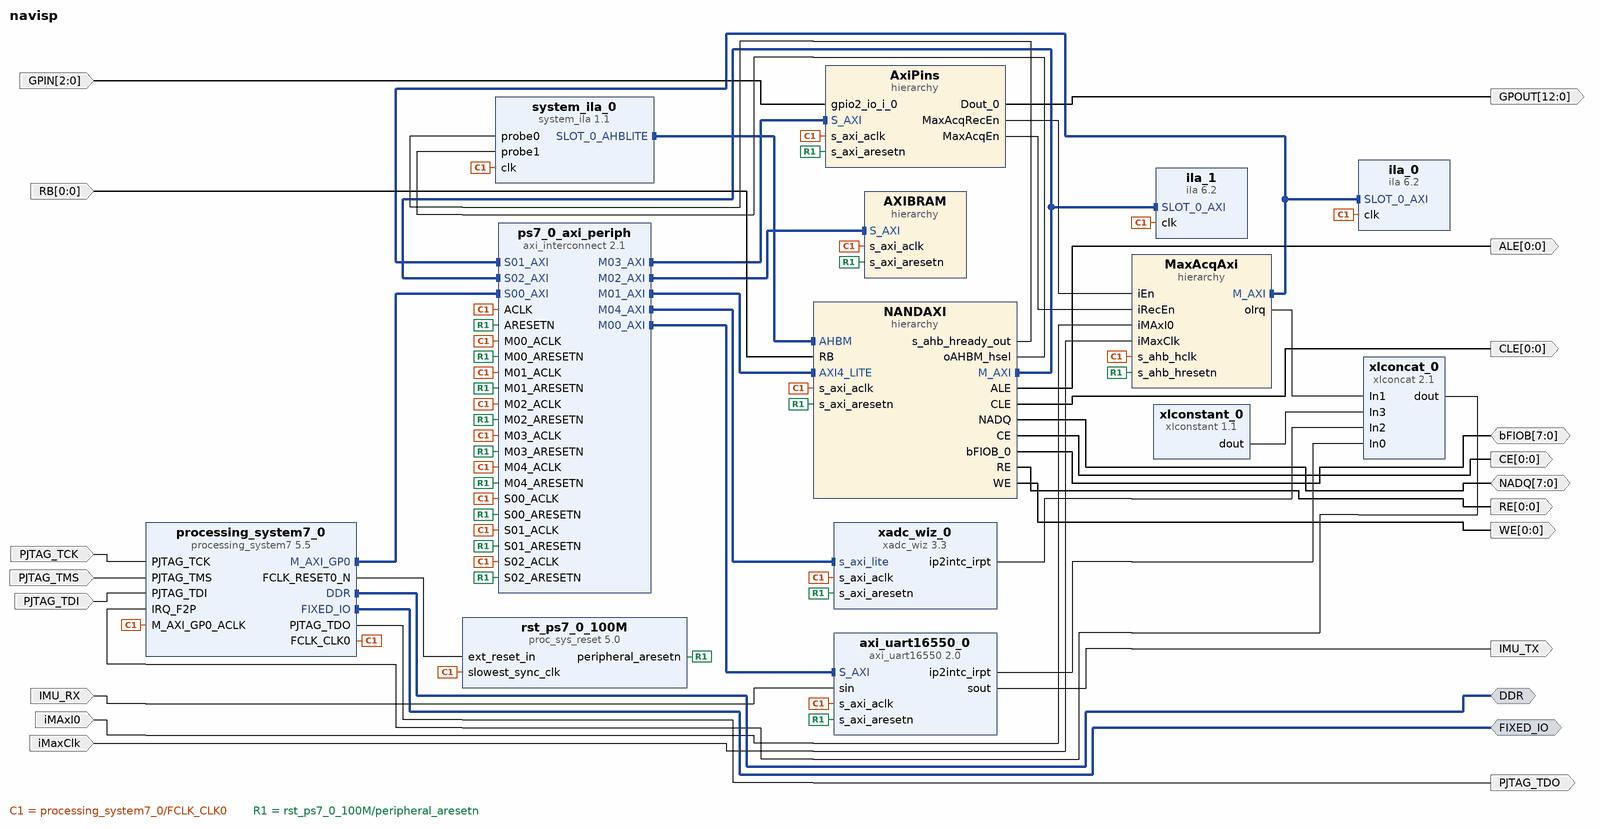
[diagram p0: block diagram of the top level]
# Vivado block design navisp, xc7z030sbg485-1, Vivado 2019.1.1
create_bd_design navisp

create_bd_intf_port -mode Master -vlnv xilinx.com:interface:ddrx_rtl:1.0 DDR
create_bd_intf_port -mode Master -vlnv xilinx.com:display_processing_system7:fixedio_rtl:1.0 FIXED_IO
create_bd_port -dir I -type clk PJTAG_TCK
create_bd_port -dir I PJTAG_TMS
create_bd_port -dir I PJTAG_TDI
create_bd_port -dir O PJTAG_TDO
create_bd_port -dir I iMAxI0
create_bd_port -dir I iMaxClk
create_bd_port -dir IO -from 7 -to 0 NADQ
create_bd_port -dir O -from 0 -to 0 CLE
create_bd_port -dir O -from 0 -to 0 ALE
create_bd_port -dir O -from 0 -to 0 RE
create_bd_port -dir O -from 0 -to 0 CE
create_bd_port -dir O -from 0 -to 0 WE
create_bd_port -dir I -from 0 -to 0 RB
create_bd_port -dir I -from 2 -to 0 GPIN
create_bd_port -dir I IMU_RX
create_bd_port -dir O IMU_TX
create_bd_port -dir IO -from 7 -to 0 bFIOB
create_bd_port -dir O -from 12 -to 0 GPOUT

create_bd_cell -type ip -vlnv xilinx.com:ip:axi_interconnect:2.1 ps7_0_axi_periph
set_property -dict {CONFIG.ENABLE_ADVANCED_OPTIONS 0 CONFIG.NUM_MI 5 CONFIG.NUM_SI 3} [get_bd_cells ps7_0_axi_periph]
create_bd_cell -type hier AXIBRAM
create_bd_cell -type hier NANDAXI
create_bd_cell -type hier AxiPins
create_bd_cell -type hier MaxAcqAxi
create_bd_cell -type ip -vlnv xilinx.com:ip:ila:6.2 ila_0
set_property -dict [list \
  CONFIG.ALL_PROBE_SAME_MU true \
  CONFIG.C_ADV_TRIGGER false \
  CONFIG.C_ENABLE_ILA_AXI_MON true \
  CONFIG.C_MONITOR_TYPE AXI \
  CONFIG.C_NUM_OF_PROBES 44 \
] [get_bd_cells ila_0]
create_bd_cell -type ip -vlnv xilinx.com:ip:ila:6.2 ila_1
set_property -dict [list \
  CONFIG.ALL_PROBE_SAME_MU true \
  CONFIG.C_ADV_TRIGGER false \
  CONFIG.C_DATA_DEPTH 8192 \
  CONFIG.C_ENABLE_ILA_AXI_MON true \
  CONFIG.C_MONITOR_TYPE AXI \
  CONFIG.C_NUM_OF_PROBES 44 \
] [get_bd_cells ila_1]
create_bd_cell -type ip -vlnv xilinx.com:ip:processing_system7:5.5 processing_system7_0
set_property -dict [list \
  CONFIG.PCW_APU_PERIPHERAL_FREQMHZ 667 \
  CONFIG.PCW_ENET0_PERIPHERAL_ENABLE 0 \
  CONFIG.PCW_ENET1_PERIPHERAL_CLKSRC External \
  CONFIG.PCW_FPGA0_PERIPHERAL_FREQMHZ 100 \
  CONFIG.PCW_FPGA1_PERIPHERAL_FREQMHZ 100 \
  CONFIG.PCW_FPGA2_PERIPHERAL_FREQMHZ 33.333333 \
  CONFIG.PCW_GPIO_MIO_GPIO_ENABLE 1 \
  CONFIG.PCW_GPIO_MIO_GPIO_IO MIO \
  CONFIG.PCW_GPIO_PERIPHERAL_ENABLE 1 \
  CONFIG.PCW_I2C_RESET_ENABLE 0 \
  CONFIG.PCW_IRQ_F2P_INTR 1 \
  CONFIG.PCW_PERIPHERAL_BOARD_PRESET part0 \
  CONFIG.PCW_PJTAG_PERIPHERAL_ENABLE 1 \
  CONFIG.PCW_PJTAG_PJTAG_IO EMIO \
  CONFIG.PCW_PRESET_BANK1_VOLTAGE {LVCMOS 1.8V} \
  CONFIG.PCW_QSPI_GRP_FBCLK_ENABLE 1 \
  CONFIG.PCW_QSPI_GRP_FBCLK_IO {MIO 8} \
  CONFIG.PCW_QSPI_GRP_SINGLE_SS_ENABLE 1 \
  CONFIG.PCW_QSPI_GRP_SINGLE_SS_IO {MIO 1 .. 6} \
  CONFIG.PCW_QSPI_PERIPHERAL_ENABLE 1 \
  CONFIG.PCW_QSPI_QSPI_IO {MIO 1 .. 6} \
  CONFIG.PCW_SD0_PERIPHERAL_ENABLE 0 \
  CONFIG.PCW_SD1_PERIPHERAL_ENABLE 1 \
  CONFIG.PCW_SD1_SD1_IO {MIO 10 .. 15} \
  CONFIG.PCW_SDIO_PERIPHERAL_FREQMHZ 25 \
  CONFIG.PCW_SINGLE_QSPI_DATA_MODE x4 \
  CONFIG.PCW_SPI0_GRP_SS1_ENABLE 1 \
  CONFIG.PCW_SPI0_GRP_SS2_ENABLE 1 \
  CONFIG.PCW_SPI0_PERIPHERAL_ENABLE 1 \
  CONFIG.PCW_SPI0_SPI0_IO {MIO 40 .. 45} \
  CONFIG.PCW_TRACE_INTERNAL_WIDTH 16 \
  CONFIG.PCW_UART0_PERIPHERAL_ENABLE 1 \
  CONFIG.PCW_UART0_UART0_IO {MIO 46 .. 47} \
  CONFIG.PCW_UART1_PERIPHERAL_ENABLE 1 \
  CONFIG.PCW_UART1_UART1_IO {MIO 48 .. 49} \
  CONFIG.PCW_UART_PERIPHERAL_FREQMHZ 50 \
  CONFIG.PCW_UIPARAM_DDR_FREQ_MHZ 533.333333 \
  CONFIG.PCW_UIPARAM_DDR_MEMORY_TYPE {DDR 3 (Low Voltage)} \
  CONFIG.PCW_UIPARAM_DDR_PARTNO {MT41K256M16 RE-125} \
  CONFIG.PCW_USB0_PERIPHERAL_ENABLE 0 \
  CONFIG.PCW_USB_RESET_ENABLE 0 \
  CONFIG.PCW_USE_FABRIC_INTERRUPT 1 \
] [get_bd_cells processing_system7_0]
# 508 more settings of processing_system7_0 are not shown: defaults, MIO pin electricals, DDR timing, and values the tool derives
create_bd_cell -type ip -vlnv xilinx.com:ip:proc_sys_reset:5.0 rst_ps7_0_100M
create_bd_cell -type ip -vlnv xilinx.com:ip:system_ila:1.1 system_ila_0
set_property -dict [list \
  CONFIG.C_DATA_DEPTH 8192 \
  CONFIG.C_MON_TYPE MIX \
  CONFIG.C_NUM_MONITOR_SLOTS 1 \
  CONFIG.C_NUM_OF_PROBES 2 \
  CONFIG.C_PROBE0_TYPE 0 \
  CONFIG.C_PROBE1_TYPE 0 \
  CONFIG.C_SLOT_0_INTF_TYPE xilinx.com:interface:ahblite_rtl:2.0 \
  CONFIG.C_SLOT_0_TYPE 0 \
] [get_bd_cells system_ila_0]
create_bd_cell -type ip -vlnv xilinx.com:ip:axi_uart16550:2.0 axi_uart16550_0
create_bd_cell -type ip -vlnv xilinx.com:ip:xlconcat:2.1 xlconcat_0
set_property -dict [list \
  CONFIG.IN0_WIDTH 1 \
  CONFIG.IN1_WIDTH 1 \
  CONFIG.IN2_WIDTH 1 \
  CONFIG.IN3_WIDTH 13 \
  CONFIG.NUM_PORTS 4 \
] [get_bd_cells xlconcat_0]
create_bd_cell -type ip -vlnv xilinx.com:ip:xlconstant:1.1 xlconstant_0
set_property -dict {CONFIG.CONST_VAL 0 CONFIG.CONST_WIDTH 13} [get_bd_cells xlconstant_0]
create_bd_cell -type ip -vlnv xilinx.com:ip:xadc_wiz:3.3 xadc_wiz_0
set_property -dict [list \
  CONFIG.ADC_CONVERSION_RATE 100 \
  CONFIG.ADC_OFFSET_AND_GAIN_CALIBRATION false \
  CONFIG.AVERAGE_ENABLE_TEMPERATURE true \
  CONFIG.AVERAGE_ENABLE_VBRAM true \
  CONFIG.AVERAGE_ENABLE_VCCAUX true \
  CONFIG.AVERAGE_ENABLE_VCCDDRO true \
  CONFIG.AVERAGE_ENABLE_VCCINT true \
  CONFIG.AVERAGE_ENABLE_VCCPAUX true \
  CONFIG.AVERAGE_ENABLE_VCCPINT true \
  CONFIG.CHANNEL_ENABLE_TEMPERATURE true \
  CONFIG.CHANNEL_ENABLE_VBRAM true \
  CONFIG.CHANNEL_ENABLE_VCCAUX true \
  CONFIG.CHANNEL_ENABLE_VCCDDRO true \
  CONFIG.CHANNEL_ENABLE_VCCINT true \
  CONFIG.CHANNEL_ENABLE_VCCPAUX true \
  CONFIG.CHANNEL_ENABLE_VCCPINT true \
  CONFIG.CHANNEL_ENABLE_VP_VN false \
  CONFIG.ENABLE_CALIBRATION_AVERAGING false \
  CONFIG.ENABLE_VCCDDRO_ALARM false \
  CONFIG.ENABLE_VCCPAUX_ALARM false \
  CONFIG.ENABLE_VCCPINT_ALARM false \
  CONFIG.EXTERNAL_MUX_CHANNEL VP_VN \
  CONFIG.OT_ALARM false \
  CONFIG.SENSOR_OFFSET_AND_GAIN_CALIBRATION false \
  CONFIG.SEQUENCER_MODE Continuous \
  CONFIG.SINGLE_CHANNEL_ENABLE_CALIBRATION true \
  CONFIG.SINGLE_CHANNEL_SELECTION TEMPERATURE \
  CONFIG.TIMING_MODE Continuous \
  CONFIG.USER_TEMP_ALARM false \
  CONFIG.VCCAUX_ALARM false \
  CONFIG.VCCINT_ALARM false \
  CONFIG.XADC_STARUP_SELECTION channel_sequencer \
] [get_bd_cells xadc_wiz_0]

# ---- hierarchy /AXIBRAM ----
current_bd_instance /AXIBRAM
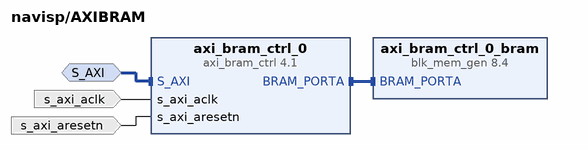
[diagram p1: block diagram inside /AXIBRAM]
create_bd_intf_pin -mode Slave -vlnv xilinx.com:interface:aximm_rtl:1.0 S_AXI
create_bd_pin -dir I -type clk s_axi_aclk
create_bd_pin -dir I -type rst s_axi_aresetn

create_bd_cell -type ip -vlnv xilinx.com:ip:axi_bram_ctrl:4.1 axi_bram_ctrl_0
set_property -dict {CONFIG.SINGLE_PORT_BRAM 1} [get_bd_cells axi_bram_ctrl_0]
create_bd_cell -type ip -vlnv xilinx.com:ip:blk_mem_gen:8.4 axi_bram_ctrl_0_bram
set_property -dict [list \
  CONFIG.Memory_Type Single_Port_RAM \
  CONFIG.Port_B_Clock 0 \
  CONFIG.Port_B_Enable_Rate 0 \
  CONFIG.Port_B_Write_Rate 0 \
] [get_bd_cells axi_bram_ctrl_0_bram]

# ---- hierarchy /NANDAXI ----
current_bd_instance /NANDAXI
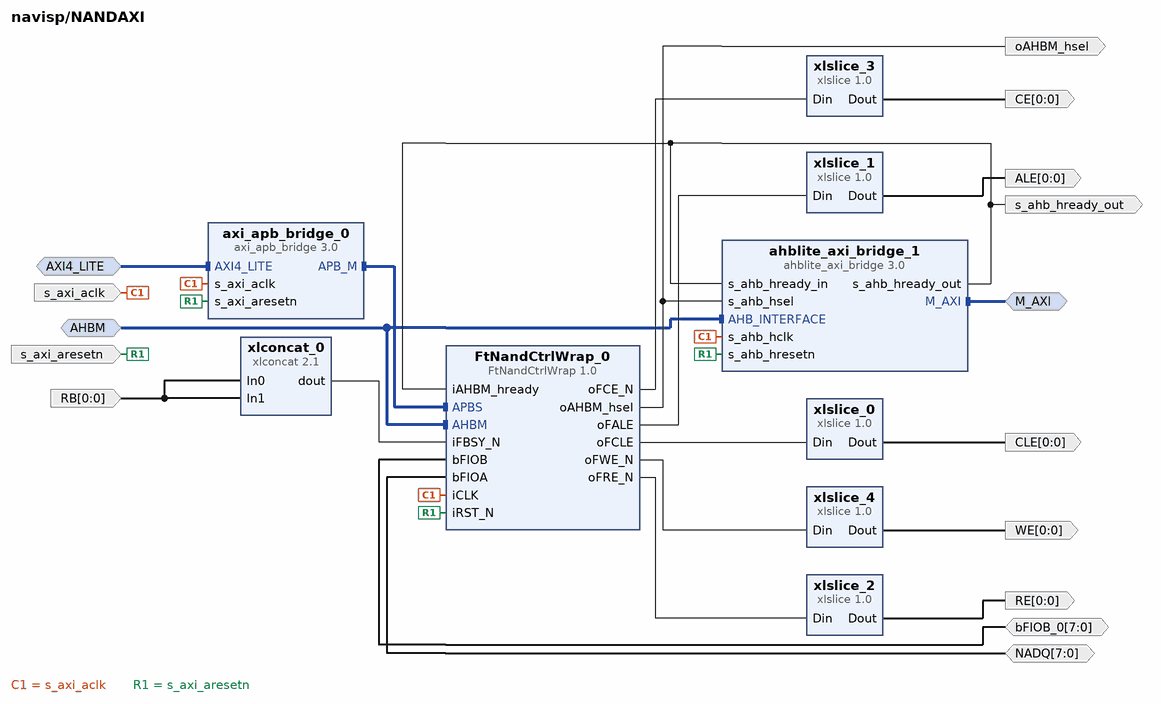
[diagram p2: block diagram inside /NANDAXI]
create_bd_intf_pin -mode Master -vlnv xilinx.com:interface:aximm_rtl:1.0 M_AXI
create_bd_intf_pin -mode Slave -vlnv xilinx.com:interface:aximm_rtl:1.0 AXI4_LITE
create_bd_intf_pin -mode Monitor -vlnv xilinx.com:interface:ahblite_rtl:2.0 AHBM
create_bd_pin -dir I -from 0 -to 0 RB
create_bd_pin -dir O -from 0 -to 0 ALE
create_bd_pin -dir O -from 0 -to 0 RE
create_bd_pin -dir O -from 0 -to 0 CE
create_bd_pin -dir O -from 0 -to 0 WE
create_bd_pin -dir I -type clk s_axi_aclk
create_bd_pin -dir I -type rst s_axi_aresetn
create_bd_pin -dir IO -from 7 -to 0 NADQ
create_bd_pin -dir O -from 0 -to 0 CLE
create_bd_pin -dir IO -from 7 -to 0 bFIOB_0
create_bd_pin -dir O s_ahb_hready_out
create_bd_pin -dir O oAHBM_hsel

create_bd_cell -type ip -vlnv xilinx.com:ip:xlconcat:2.1 xlconcat_0
create_bd_cell -type ip -vlnv xilinx.com:ip:xlslice:1.0 xlslice_1
set_property -dict {CONFIG.DIN_FROM 1 CONFIG.DIN_TO 1 CONFIG.DIN_WIDTH 2 CONFIG.DOUT_WIDTH 1} [get_bd_cells xlslice_1]
create_bd_cell -type ip -vlnv xilinx.com:ip:xlslice:1.0 xlslice_2
set_property -dict {CONFIG.DIN_FROM 1 CONFIG.DIN_TO 1 CONFIG.DIN_WIDTH 2 CONFIG.DOUT_WIDTH 1} [get_bd_cells xlslice_2]
create_bd_cell -type ip -vlnv xilinx.com:ip:xlslice:1.0 xlslice_3
set_property -dict {CONFIG.DIN_FROM 0 CONFIG.DIN_TO 0 CONFIG.DIN_WIDTH 16 CONFIG.DOUT_WIDTH 1} [get_bd_cells xlslice_3]
create_bd_cell -type ip -vlnv xilinx.com:ip:xlslice:1.0 xlslice_4
set_property -dict {CONFIG.DIN_FROM 1 CONFIG.DIN_TO 1 CONFIG.DIN_WIDTH 2 CONFIG.DOUT_WIDTH 1} [get_bd_cells xlslice_4]
create_bd_cell -type ip -vlnv xilinx.com:ip:ahblite_axi_bridge:3.0 ahblite_axi_bridge_1
create_bd_cell -type ip -vlnv xilinx.com:ip:axi_apb_bridge:3.0 axi_apb_bridge_0
set_property -dict {CONFIG.C_APB_NUM_SLAVES 1 CONFIG.C_M_APB_PROTOCOL apb4} [get_bd_cells axi_apb_bridge_0]
create_bd_cell -type ip -vlnv xilinx.com:ip:xlslice:1.0 xlslice_0
set_property -dict {CONFIG.DIN_FROM 1 CONFIG.DIN_TO 1 CONFIG.DIN_WIDTH 2 CONFIG.DOUT_WIDTH 1} [get_bd_cells xlslice_0]
create_bd_cell -type ip -vlnv cbkpan:hipero:FtNandCtrlWrap:1.0 FtNandCtrlWrap_0

# ---- hierarchy /AxiPins ----
current_bd_instance /AxiPins
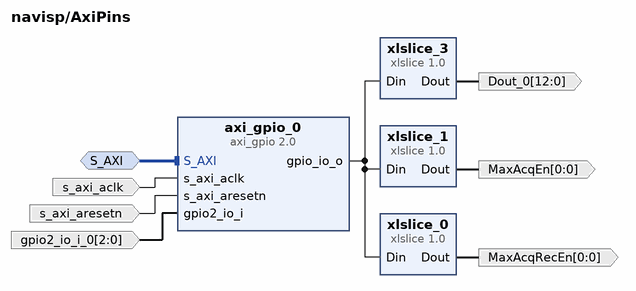
[diagram p3: block diagram inside /AxiPins]
create_bd_intf_pin -mode Slave -vlnv xilinx.com:interface:aximm_rtl:1.0 S_AXI
create_bd_pin -dir O -from 0 -to 0 MaxAcqEn
create_bd_pin -dir I -type clk s_axi_aclk
create_bd_pin -dir I -type rst s_axi_aresetn
create_bd_pin -dir O -from 0 -to 0 MaxAcqRecEn
create_bd_pin -dir I -from 2 -to 0 gpio2_io_i_0
create_bd_pin -dir O -from 12 -to 0 Dout_0

create_bd_cell -type ip -vlnv xilinx.com:ip:xlslice:1.0 xlslice_1
set_property -dict {CONFIG.DIN_FROM 0 CONFIG.DIN_TO 0 CONFIG.DIN_WIDTH 15} [get_bd_cells xlslice_1]
create_bd_cell -type ip -vlnv xilinx.com:ip:xlslice:1.0 xlslice_0
set_property -dict {CONFIG.DIN_FROM 1 CONFIG.DIN_TO 1 CONFIG.DIN_WIDTH 15} [get_bd_cells xlslice_0]
create_bd_cell -type ip -vlnv xilinx.com:ip:xlslice:1.0 xlslice_3
set_property -dict {CONFIG.DIN_FROM 14 CONFIG.DIN_TO 2 CONFIG.DIN_WIDTH 15 CONFIG.DOUT_WIDTH 13} [get_bd_cells xlslice_3]
create_bd_cell -type ip -vlnv xilinx.com:ip:axi_gpio:2.0 axi_gpio_0
set_property -dict [list \
  CONFIG.C_ALL_INPUTS_2 1 \
  CONFIG.C_ALL_OUTPUTS 1 \
  CONFIG.C_GPIO2_WIDTH 3 \
  CONFIG.C_GPIO_WIDTH 15 \
  CONFIG.C_IS_DUAL 1 \
  CONFIG.GPIO_BOARD_INTERFACE Custom \
  CONFIG.USE_BOARD_FLOW true \
] [get_bd_cells axi_gpio_0]

# ---- hierarchy /MaxAcqAxi ----
current_bd_instance /MaxAcqAxi
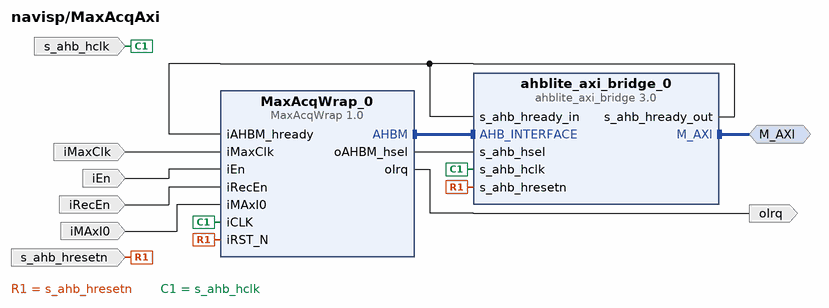
[diagram p4: block diagram inside /MaxAcqAxi]
create_bd_intf_pin -mode Master -vlnv xilinx.com:interface:aximm_rtl:1.0 M_AXI
create_bd_pin -dir I -type rst s_ahb_hresetn
create_bd_pin -dir I -type clk s_ahb_hclk
create_bd_pin -dir I iMAxI0
create_bd_pin -dir I iMaxClk
create_bd_pin -dir I iRecEn
create_bd_pin -dir I iEn
create_bd_pin -dir O -type intr oIrq

create_bd_cell -type ip -vlnv xilinx.com:ip:ahblite_axi_bridge:3.0 ahblite_axi_bridge_0
create_bd_cell -type ip -vlnv cbkpan:hipero:MaxAcqWrap:1.0 MaxAcqWrap_0

# ---- connections ----

current_bd_instance /AXIBRAM
connect_bd_intf_net [get_bd_intf_pins S_AXI] [get_bd_intf_pins axi_bram_ctrl_0/S_AXI]
connect_bd_intf_net [get_bd_intf_pins axi_bram_ctrl_0_bram/BRAM_PORTA] [get_bd_intf_pins axi_bram_ctrl_0/BRAM_PORTA]
connect_bd_net -net processing_system7_0_FCLK_CLK0 [get_bd_pins s_axi_aclk] [get_bd_pins axi_bram_ctrl_0/s_axi_aclk]
connect_bd_net -net rst_ps7_0_100M_peripheral_aresetn [get_bd_pins s_axi_aresetn] [get_bd_pins axi_bram_ctrl_0/s_axi_aresetn]
set_property HDL_ATTRIBUTE.BMM_INFO_ADDRESS_SPACE {byte  0x40000000 32 > navisp AXIBRAM/axi_bram_ctrl_0_bram} [get_bd_cells axi_bram_ctrl_0]
set_property HDL_ATTRIBUTE.KEEP_HIERARCHY yes [get_bd_cells axi_bram_ctrl_0]

current_bd_instance /NANDAXI
connect_bd_intf_net -intf_net S02_AXI_1 [get_bd_intf_pins M_AXI] [get_bd_intf_pins ahblite_axi_bridge_1/M_AXI]
connect_bd_intf_net -intf_net FtNandCtrlWrap_0_AHBM [get_bd_intf_pins FtNandCtrlWrap_0/AHBM] [get_bd_intf_pins ahblite_axi_bridge_1/AHB_INTERFACE]
connect_bd_intf_net [get_bd_intf_pins FtNandCtrlWrap_0/AHBM] [get_bd_intf_pins AHBM]
connect_bd_intf_net [get_bd_intf_pins AXI4_LITE] [get_bd_intf_pins axi_apb_bridge_0/AXI4_LITE]
connect_bd_intf_net [get_bd_intf_pins axi_apb_bridge_0/APB_M] [get_bd_intf_pins FtNandCtrlWrap_0/APBS]
connect_bd_net -net In1_0_1 [get_bd_pins RB] [get_bd_pins xlconcat_0/In1] [get_bd_pins xlconcat_0/In0]
connect_bd_net -net NandCtrlAxi_Dout_1 [get_bd_pins xlslice_1/Dout] [get_bd_pins ALE]
connect_bd_net -net NandCtrlAxi_Dout_2 [get_bd_pins xlslice_2/Dout] [get_bd_pins RE]
connect_bd_net -net NandCtrlAxi_Dout_3 [get_bd_pins xlslice_3/Dout] [get_bd_pins CE]
connect_bd_net -net NandCtrlAxi_Dout_4 [get_bd_pins xlslice_4/Dout] [get_bd_pins WE]
connect_bd_net -net processing_system7_0_FCLK_CLK0 [get_bd_pins s_axi_aclk] \
  [get_bd_pins axi_apb_bridge_0/s_axi_aclk] [get_bd_pins ahblite_axi_bridge_1/s_ahb_hclk] [get_bd_pins FtNandCtrlWrap_0/iCLK]
connect_bd_net -net rst_ps7_0_100M_peripheral_aresetn [get_bd_pins s_axi_aresetn] \
  [get_bd_pins axi_apb_bridge_0/s_axi_aresetn] [get_bd_pins ahblite_axi_bridge_1/s_ahb_hresetn] \
  [get_bd_pins FtNandCtrlWrap_0/iRST_N]
connect_bd_net -net NandCtrlAxi_Dout_0 [get_bd_pins xlslice_0/Dout] [get_bd_pins CLE]
connect_bd_net -net ahblite_axi_bridge_1_s_ahb_hready_out [get_bd_pins ahblite_axi_bridge_1/s_ahb_hready_out] \
  [get_bd_pins ahblite_axi_bridge_1/s_ahb_hready_in] [get_bd_pins s_ahb_hready_out] \
  [get_bd_pins FtNandCtrlWrap_0/iAHBM_hready]
connect_bd_net [get_bd_pins FtNandCtrlWrap_0/oFALE] [get_bd_pins xlslice_1/Din]
connect_bd_net [get_bd_pins bFIOB_0] [get_bd_pins FtNandCtrlWrap_0/bFIOB]
connect_bd_net [get_bd_pins FtNandCtrlWrap_0/oFRE_N] [get_bd_pins xlslice_2/Din]
connect_bd_net [get_bd_pins FtNandCtrlWrap_0/oFWE_N] [get_bd_pins xlslice_4/Din]
connect_bd_net [get_bd_pins xlconcat_0/dout] [get_bd_pins FtNandCtrlWrap_0/iFBSY_N]
connect_bd_net [get_bd_pins NADQ] [get_bd_pins FtNandCtrlWrap_0/bFIOA]
connect_bd_net [get_bd_pins FtNandCtrlWrap_0/oFCE_N] [get_bd_pins xlslice_3/Din]
connect_bd_net [get_bd_pins FtNandCtrlWrap_0/oFCLE] [get_bd_pins xlslice_0/Din]
connect_bd_net -net FtNandCtrlWrap_0_oAHBM_hsel [get_bd_pins FtNandCtrlWrap_0/oAHBM_hsel] \
  [get_bd_pins ahblite_axi_bridge_1/s_ahb_hsel] [get_bd_pins oAHBM_hsel]
set_property HDL_ATTRIBUTE.DEBUG true [get_bd_intf_nets FtNandCtrlWrap_0_AHBM]
set_property HDL_ATTRIBUTE.MARK_DEBUG true [get_bd_intf_nets FtNandCtrlWrap_0_AHBM]
set_property HDL_ATTRIBUTE.DEBUG true [get_bd_nets ahblite_axi_bridge_1_s_ahb_hready_out]
set_property HDL_ATTRIBUTE.MARK_DEBUG true [get_bd_nets ahblite_axi_bridge_1_s_ahb_hready_out]
set_property HDL_ATTRIBUTE.DEBUG true [get_bd_nets FtNandCtrlWrap_0_oAHBM_hsel]
set_property HDL_ATTRIBUTE.MARK_DEBUG true [get_bd_nets FtNandCtrlWrap_0_oAHBM_hsel]

current_bd_instance /AxiPins
connect_bd_intf_net [get_bd_intf_pins S_AXI] [get_bd_intf_pins axi_gpio_0/S_AXI]
connect_bd_net -net axi_gpio_0_gpio2_io_o [get_bd_pins axi_gpio_0/gpio_io_o] \
  [get_bd_pins xlslice_0/Din] [get_bd_pins xlslice_1/Din] [get_bd_pins xlslice_3/Din]
connect_bd_net [get_bd_pins xlslice_1/Dout] [get_bd_pins MaxAcqEn]
connect_bd_net -net processing_system7_0_FCLK_CLK0 [get_bd_pins s_axi_aclk] [get_bd_pins axi_gpio_0/s_axi_aclk]
connect_bd_net -net rst_ps7_0_100M_peripheral_aresetn [get_bd_pins s_axi_aresetn] [get_bd_pins axi_gpio_0/s_axi_aresetn]
connect_bd_net [get_bd_pins xlslice_0/Dout] [get_bd_pins MaxAcqRecEn]
connect_bd_net -net gpio2_io_i_0_1 [get_bd_pins gpio2_io_i_0] [get_bd_pins axi_gpio_0/gpio2_io_i]
connect_bd_net [get_bd_pins xlslice_3/Dout] [get_bd_pins Dout_0]

current_bd_instance /MaxAcqAxi
connect_bd_intf_net [get_bd_intf_pins MaxAcqWrap_0/AHBM] [get_bd_intf_pins ahblite_axi_bridge_0/AHB_INTERFACE]
connect_bd_intf_net [get_bd_intf_pins M_AXI] [get_bd_intf_pins ahblite_axi_bridge_0/M_AXI]
connect_bd_net -net rst_ps7_0_100M_peripheral_aresetn [get_bd_pins s_ahb_hresetn] \
  [get_bd_pins ahblite_axi_bridge_0/s_ahb_hresetn] [get_bd_pins MaxAcqWrap_0/iRST_N]
connect_bd_net -net processing_system7_0_FCLK_CLK0 [get_bd_pins s_ahb_hclk] \
  [get_bd_pins ahblite_axi_bridge_0/s_ahb_hclk] [get_bd_pins MaxAcqWrap_0/iCLK]
connect_bd_net [get_bd_pins ahblite_axi_bridge_0/s_ahb_hready_out] \
  [get_bd_pins ahblite_axi_bridge_0/s_ahb_hready_in] [get_bd_pins MaxAcqWrap_0/iAHBM_hready]
connect_bd_net [get_bd_pins iMaxClk] [get_bd_pins MaxAcqWrap_0/iMaxClk]
connect_bd_net [get_bd_pins iEn] [get_bd_pins MaxAcqWrap_0/iEn]
connect_bd_net [get_bd_pins iRecEn] [get_bd_pins MaxAcqWrap_0/iRecEn]
connect_bd_net -net iMAxI0_1 [get_bd_pins iMAxI0] [get_bd_pins MaxAcqWrap_0/iMAxI0]
connect_bd_net [get_bd_pins MaxAcqWrap_0/oAHBM_hsel] [get_bd_pins ahblite_axi_bridge_0/s_ahb_hsel]
connect_bd_net [get_bd_pins MaxAcqWrap_0/oIrq] [get_bd_pins oIrq]

current_bd_instance /
connect_bd_intf_net [get_bd_intf_pins ps7_0_axi_periph/M04_AXI] [get_bd_intf_pins xadc_wiz_0/s_axi_lite]
connect_bd_intf_net [get_bd_intf_pins ps7_0_axi_periph/M03_AXI] [get_bd_intf_pins AxiPins/S_AXI]
connect_bd_intf_net [get_bd_intf_ports DDR] [get_bd_intf_pins processing_system7_0/DDR]
connect_bd_intf_net [get_bd_intf_pins ps7_0_axi_periph/M02_AXI] [get_bd_intf_pins AXIBRAM/S_AXI]
connect_bd_intf_net [get_bd_intf_pins processing_system7_0/M_AXI_GP0] [get_bd_intf_pins ps7_0_axi_periph/S00_AXI]
connect_bd_intf_net [get_bd_intf_pins axi_uart16550_0/S_AXI] [get_bd_intf_pins ps7_0_axi_periph/M00_AXI]
connect_bd_intf_net [get_bd_intf_pins NANDAXI/AXI4_LITE] [get_bd_intf_pins ps7_0_axi_periph/M01_AXI]
connect_bd_intf_net -intf_net ahblite_axi_bridge_0_M_AXI [get_bd_intf_pins MaxAcqAxi/M_AXI] [get_bd_intf_pins ps7_0_axi_periph/S01_AXI]
connect_bd_intf_net [get_bd_intf_pins MaxAcqAxi/M_AXI] [get_bd_intf_pins ila_0/SLOT_0_AXI]
connect_bd_intf_net -intf_net Conn [get_bd_intf_pins system_ila_0/SLOT_0_AHBLITE] [get_bd_intf_pins NANDAXI/AHBM]
connect_bd_intf_net [get_bd_intf_ports FIXED_IO] [get_bd_intf_pins processing_system7_0/FIXED_IO]
connect_bd_intf_net [get_bd_intf_pins ps7_0_axi_periph/S02_AXI] [get_bd_intf_pins NANDAXI/M_AXI]
connect_bd_intf_net [get_bd_intf_pins ps7_0_axi_periph/S02_AXI] [get_bd_intf_pins ila_1/SLOT_0_AXI]
connect_bd_net [get_bd_pins processing_system7_0/FCLK_CLK0] \
  [get_bd_pins ps7_0_axi_periph/S00_ACLK] [get_bd_pins ps7_0_axi_periph/M00_ACLK] [get_bd_pins ps7_0_axi_periph/ACLK] \
  [get_bd_pins ps7_0_axi_periph/M01_ACLK] [get_bd_pins ps7_0_axi_periph/M02_ACLK] [get_bd_pins ps7_0_axi_periph/S01_ACLK] \
  [get_bd_pins ps7_0_axi_periph/S02_ACLK] [get_bd_pins AXIBRAM/s_axi_aclk] [get_bd_pins ps7_0_axi_periph/M03_ACLK] \
  [get_bd_pins NANDAXI/s_axi_aclk] [get_bd_pins AxiPins/s_axi_aclk] [get_bd_pins MaxAcqAxi/s_ahb_hclk] \
  [get_bd_pins ila_0/clk] [get_bd_pins ila_1/clk] [get_bd_pins processing_system7_0/M_AXI_GP0_ACLK] \
  [get_bd_pins rst_ps7_0_100M/slowest_sync_clk] [get_bd_pins system_ila_0/clk] [get_bd_pins axi_uart16550_0/s_axi_aclk] \
  [get_bd_pins xadc_wiz_0/s_axi_aclk] [get_bd_pins ps7_0_axi_periph/M04_ACLK]
connect_bd_net [get_bd_pins processing_system7_0/FCLK_RESET0_N] [get_bd_pins rst_ps7_0_100M/ext_reset_in]
connect_bd_net [get_bd_pins rst_ps7_0_100M/peripheral_aresetn] \
  [get_bd_pins ps7_0_axi_periph/S00_ARESETN] [get_bd_pins ps7_0_axi_periph/M00_ARESETN] \
  [get_bd_pins ps7_0_axi_periph/ARESETN] [get_bd_pins ps7_0_axi_periph/M01_ARESETN] \
  [get_bd_pins ps7_0_axi_periph/M02_ARESETN] [get_bd_pins ps7_0_axi_periph/S01_ARESETN] \
  [get_bd_pins ps7_0_axi_periph/S02_ARESETN] [get_bd_pins AXIBRAM/s_axi_aresetn] [get_bd_pins ps7_0_axi_periph/M03_ARESETN] \
  [get_bd_pins NANDAXI/s_axi_aresetn] [get_bd_pins AxiPins/s_axi_aresetn] [get_bd_pins MaxAcqAxi/s_ahb_hresetn] \
  [get_bd_pins axi_uart16550_0/s_axi_aresetn] [get_bd_pins xadc_wiz_0/s_axi_aresetn] \
  [get_bd_pins ps7_0_axi_periph/M04_ARESETN]
connect_bd_net -net PJTAG_TCK_0_1 [get_bd_ports PJTAG_TCK] [get_bd_pins processing_system7_0/PJTAG_TCK]
connect_bd_net -net PJTAG_TMS_0_1 [get_bd_ports PJTAG_TMS] [get_bd_pins processing_system7_0/PJTAG_TMS]
connect_bd_net -net PJTAG_TDI_0_1 [get_bd_ports PJTAG_TDI] [get_bd_pins processing_system7_0/PJTAG_TDI]
connect_bd_net [get_bd_pins processing_system7_0/PJTAG_TDO] [get_bd_ports PJTAG_TDO]
connect_bd_net -net iMAxI0_1_1 [get_bd_ports iMAxI0] [get_bd_pins MaxAcqAxi/iMAxI0]
connect_bd_net -net iMaxClk_0_1 [get_bd_ports iMaxClk] [get_bd_pins MaxAcqAxi/iMaxClk]
connect_bd_net [get_bd_ports NADQ] [get_bd_pins NANDAXI/NADQ]
connect_bd_net -net NandCtrlAxi_Dout_0 [get_bd_pins NANDAXI/CLE] [get_bd_ports CLE]
connect_bd_net -net NandCtrlAxi_Dout_1 [get_bd_pins NANDAXI/ALE] [get_bd_ports ALE]
connect_bd_net -net NandCtrlAxi_Dout_2 [get_bd_pins NANDAXI/RE] [get_bd_ports RE]
connect_bd_net -net NandCtrlAxi_Dout_3 [get_bd_pins NANDAXI/CE] [get_bd_ports CE]
connect_bd_net -net NandCtrlAxi_Dout_4 [get_bd_pins NANDAXI/WE] [get_bd_ports WE]
connect_bd_net -net In1_0_1 [get_bd_ports RB] [get_bd_pins NANDAXI/RB]
connect_bd_net -net xlslice_0_Dout [get_bd_pins AxiPins/MaxAcqRecEn] [get_bd_pins MaxAcqAxi/iEn]
connect_bd_net -net xlslice_1_Dout [get_bd_pins AxiPins/MaxAcqEn] [get_bd_pins MaxAcqAxi/iRecEn]
connect_bd_net -net gpio2_io_i_0_1 [get_bd_ports GPIN] [get_bd_pins AxiPins/gpio2_io_i_0]
connect_bd_net [get_bd_ports bFIOB] [get_bd_pins NANDAXI/bFIOB_0]
connect_bd_net -net NANDAXI_s_ahb_hready_out [get_bd_pins NANDAXI/s_ahb_hready_out] [get_bd_pins system_ila_0/probe0]
connect_bd_net -net NANDAXI_oAHBM_hsel [get_bd_pins NANDAXI/oAHBM_hsel] [get_bd_pins system_ila_0/probe1]
connect_bd_net [get_bd_pins xlconcat_0/dout] [get_bd_pins processing_system7_0/IRQ_F2P]
connect_bd_net [get_bd_pins axi_uart16550_0/ip2intc_irpt] [get_bd_pins xlconcat_0/In0]
connect_bd_net [get_bd_pins axi_uart16550_0/sout] [get_bd_ports IMU_TX]
connect_bd_net [get_bd_ports IMU_RX] [get_bd_pins axi_uart16550_0/sin]
connect_bd_net [get_bd_pins MaxAcqAxi/oIrq] [get_bd_pins xlconcat_0/In1]
connect_bd_net [get_bd_pins xlconstant_0/dout] [get_bd_pins xlconcat_0/In3]
connect_bd_net [get_bd_pins xadc_wiz_0/ip2intc_irpt] [get_bd_pins xlconcat_0/In2]
connect_bd_net [get_bd_pins AxiPins/Dout_0] [get_bd_ports GPOUT]
set_property HDL_ATTRIBUTE.BMM_INFO_PROCESSOR {arm > navisp AXIBRAM/axi_bram_ctrl_0} [get_bd_cells processing_system7_0]
set_property HDL_ATTRIBUTE.KEEP_HIERARCHY yes [get_bd_cells processing_system7_0]
set_property HDL_ATTRIBUTE.DEBUG true [get_bd_intf_nets Conn]
set_property HDL_ATTRIBUTE.DEBUG true [get_bd_nets NANDAXI_s_ahb_hready_out]
set_property HDL_ATTRIBUTE.DEBUG true [get_bd_nets NANDAXI_oAHBM_hsel]

# ---- address map ----
assign_bd_address -offset 0x40000000 -range 8K -target_address_space [get_bd_addr_spaces MaxAcqAxi/MaxAcqWrap_0/AHBM] [get_bd_addr_segs AXIBRAM/axi_bram_ctrl_0/S_AXI/Mem0]
exclude_bd_addr_seg -offset 0x41000000 -range 64K -target_address_space [get_bd_addr_spaces MaxAcqAxi/MaxAcqWrap_0/AHBM] [get_bd_addr_segs AxiPins/axi_gpio_0/S_AXI/Reg]
exclude_bd_addr_seg -offset 0x43000000 -range 64K -target_address_space [get_bd_addr_spaces MaxAcqAxi/MaxAcqWrap_0/AHBM] [get_bd_addr_segs NANDAXI/FtNandCtrlWrap_0/APBS/regs]
exclude_bd_addr_seg -offset 0x43C00000 -range 64K -target_address_space [get_bd_addr_spaces MaxAcqAxi/MaxAcqWrap_0/AHBM] [get_bd_addr_segs xadc_wiz_0/s_axi_lite/Reg]
exclude_bd_addr_seg -offset 0x44A00000 -range 64K -target_address_space [get_bd_addr_spaces MaxAcqAxi/MaxAcqWrap_0/AHBM] [get_bd_addr_segs axi_uart16550_0/S_AXI/Reg]
assign_bd_address -offset 0x40000000 -range 8K -target_address_space [get_bd_addr_spaces NANDAXI/FtNandCtrlWrap_0/AHBM] [get_bd_addr_segs AXIBRAM/axi_bram_ctrl_0/S_AXI/Mem0]
exclude_bd_addr_seg -offset 0x41000000 -range 64K -target_address_space [get_bd_addr_spaces NANDAXI/FtNandCtrlWrap_0/AHBM] [get_bd_addr_segs AxiPins/axi_gpio_0/S_AXI/Reg]
exclude_bd_addr_seg -offset 0x43000000 -range 64K -target_address_space [get_bd_addr_spaces NANDAXI/FtNandCtrlWrap_0/AHBM] [get_bd_addr_segs NANDAXI/FtNandCtrlWrap_0/APBS/regs]
exclude_bd_addr_seg -offset 0x43C00000 -range 64K -target_address_space [get_bd_addr_spaces NANDAXI/FtNandCtrlWrap_0/AHBM] [get_bd_addr_segs xadc_wiz_0/s_axi_lite/Reg]
exclude_bd_addr_seg -offset 0x44A00000 -range 64K -target_address_space [get_bd_addr_spaces NANDAXI/FtNandCtrlWrap_0/AHBM] [get_bd_addr_segs axi_uart16550_0/S_AXI/Reg]
assign_bd_address -offset 0x40000000 -range 8K -target_address_space [get_bd_addr_spaces processing_system7_0/Data] [get_bd_addr_segs AXIBRAM/axi_bram_ctrl_0/S_AXI/Mem0]
assign_bd_address -offset 0x41000000 -range 64K -target_address_space [get_bd_addr_spaces processing_system7_0/Data] [get_bd_addr_segs AxiPins/axi_gpio_0/S_AXI/Reg]
assign_bd_address -offset 0x43000000 -range 64K -target_address_space [get_bd_addr_spaces processing_system7_0/Data] [get_bd_addr_segs NANDAXI/FtNandCtrlWrap_0/APBS/regs]
assign_bd_address -offset 0x43C00000 -range 64K -target_address_space [get_bd_addr_spaces processing_system7_0/Data] [get_bd_addr_segs xadc_wiz_0/s_axi_lite/Reg]
assign_bd_address -offset 0x44A00000 -range 64K -target_address_space [get_bd_addr_spaces processing_system7_0/Data] [get_bd_addr_segs axi_uart16550_0/S_AXI/Reg]

validate_bd_design
save_bd_design
